# Altium project PM_TEST.PrjPcb
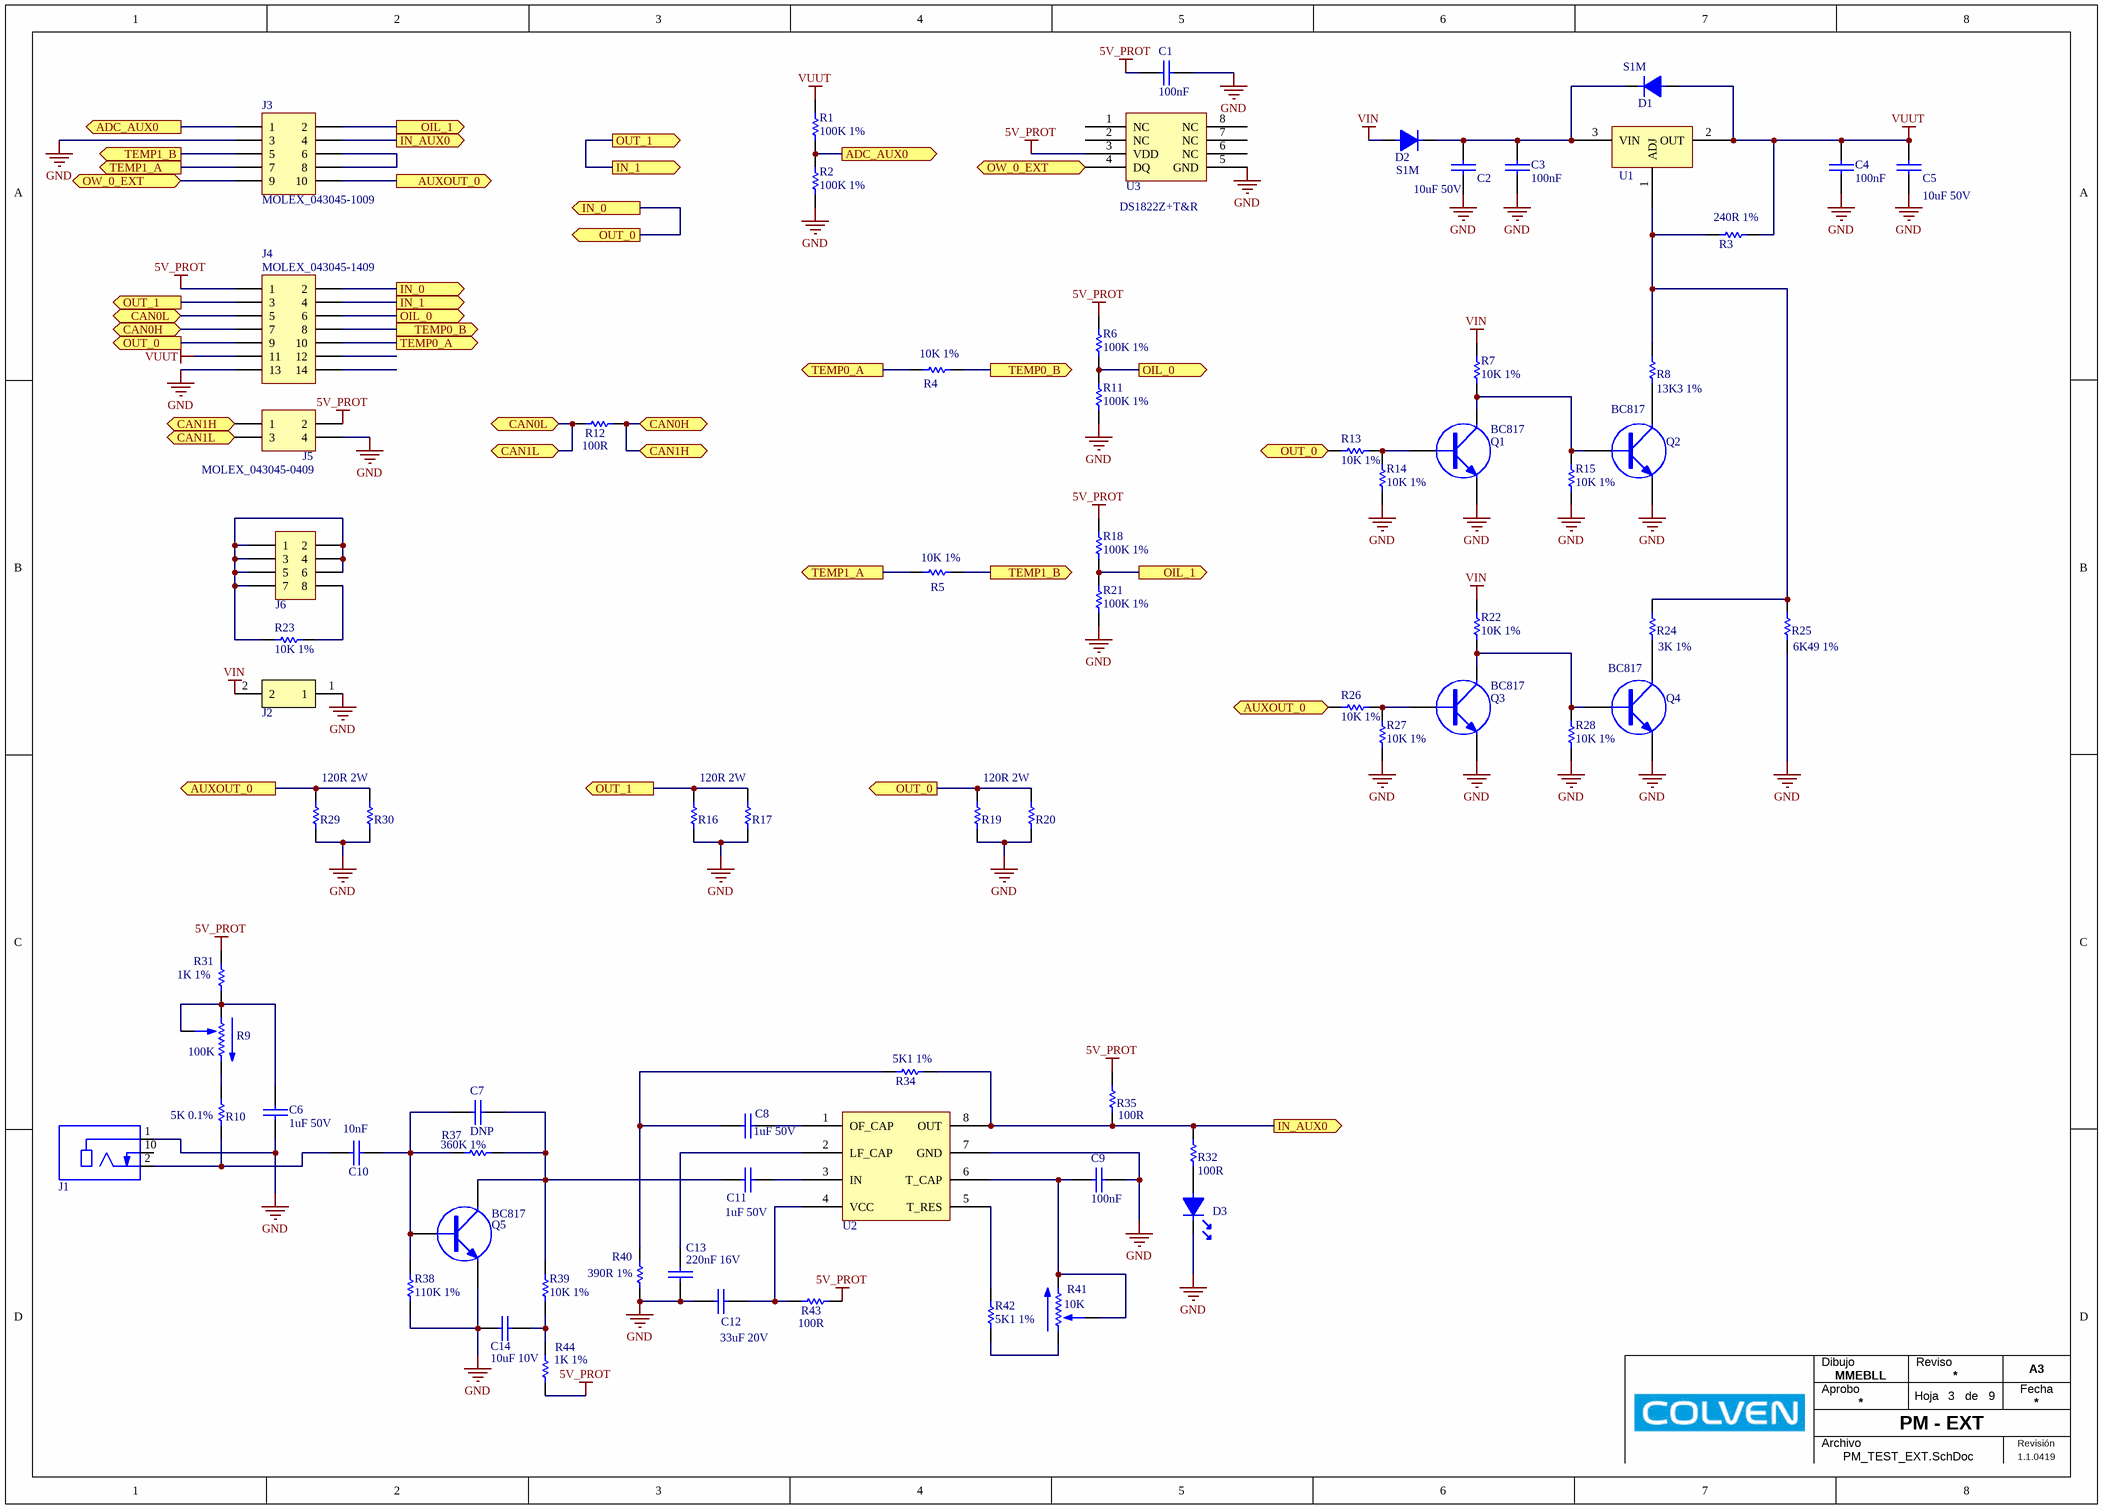
[diagram p0: PM_TEST_EXT.SchDoc]
1 sheet, 74 parts. Net scope: flat (ports and power ports of the same name join across sheets).
Board file: PM_TEST.PcbDoc

## Sheet PM_TEST_EXT.SchDoc: PM - EXT
size A3; DrawnBy: MMEBLL; Revision: 1.1.0419; SheetNumber: 3; SheetTotal: 9; PageSetup: Record=PageOptions|CenterHorizontal=True|CenterVertical=True|PrintScale=0.73|XCorrection=1.00|YCorrection=1.00|PrintKind=0|BorderSize=5000000|LeftOffset=0|BottomOffset=0|Orientation=2|PaperLength=1000|PaperWidth=1000|Scale=100|PaperSource=7|PrintQuality=-4|MediaType=1|DitherType=10|PaperKind=A4|PrintScaleMode=1

### Parts
C1  100nF  [0603]
C2  10uF 50V  [1210]
C3  100nF  [0603]
C4  100nF  [0603]
C5  10uF 50V  [1210]
C6  1uF 50V  [0603]
C7  DNP  [0603]  (no BOM)
C8  1uF 50V  [0603]
C9  100nF  [0603]
C10  10nF  [0603]
C11  1uF 50V  [0603]
C12  33uF 20V  [0805]
C13  220nF 16V  [0603]
C14  10uF 10V  [0805]
D1  S1M  [SMAK]
D2  S1M  [SMAK]
D3  AZUL  [LED0603_B]  (value not drawn)
J1  MJ-3523-SMT-TR  [MJ-3523-SMT-TR]  (value not drawn)
J2  MOLEX_0436500212  [0436500212]  (value not drawn)
J3  MOLEX_043045-1009  [043045-1009]
J4  MOLEX_043045-1409  [043045-1409]
J5  MOLEX_043045-0409  [043045-0409]
J6  75867-132LF  [75867-132LF]  (value not drawn)
Q1  BC817  [SOT23]
Q2  BC817  [SOT23]
Q3  BC817  [SOT23]
Q4  BC817  [SOT23]
Q5  BC817  [SOT23]
R1  100K 1%  [0603]
R2  100K 1%  [0603]
R3  240R 1%  [0603]
R4  10K 1%  [0603]
R5  10K 1%  [0603]
R6  100K 1%  [0603]
R7  10K 1%  [0603]
R8  13K3 1%  [0603]
R9  100K  [3386W]
R10  5K 0.1%  [0603]
R11  100K 1%  [0603]
R12  100R  [0603]
R13  10K 1%  [0603]
R14  10K 1%  [0603]
R15  10K 1%  [0603]
R16  120R 2W  [RES700]
R17  120R 2W  [RES700]  (value not drawn)
R18  100K 1%  [0603]
R19  120R 2W  [RES700]
R20  120R 2W  [RES700]  (value not drawn)
R21  100K 1%  [0603]
R22  10K 1%  [0603]
R23  10K 1%  [0603]
R24  3K 1%  [0603]
R25  6K49 1%  [0603]
R26  10K 1%  [0603]
R27  10K 1%  [0603]
R28  10K 1%  [0603]
R29  120R 2W  [RES700]
R30  120R 2W  [RES700]  (value not drawn)
R31  1K 1%  [0603]
R32  100R  [0603]
R34  5K1 1%  [0603]
R35  100R  [0603]
R37  360K 1%  [0603]
R38  110K 1%  [0603]
R39  10K 1%  [0603]
R40  390R 1%  [0603]
R41  10K  [3386W]
R42  5K1 1%  [0603]
R43  100R  [0603]
R44  1K 1%  [0603]
ROT?  Rotulo_A3  (value not drawn)  (graphical)
U1  LM317MBDTRKG  [DPAK]  (value not drawn)
U2  LM567C  [SOIC8]  (value not drawn)
U3  DS1822Z+T&R  [SOIC8]

### Ports
ADC_AUX0 (out), AUXOUT_0 (out), CAN0H (bidir), CAN0L (bidir), CAN1H (bidir), CAN1L (bidir), IN_0 (out), IN_1 (out), IN_AUX0 (out), OIL_0 (out), OIL_1 (out), OUT_0 (out), OUT_1 (out), OW_0_EXT (bidir), TEMP0_A (out), TEMP0_B (out), TEMP1_A (out), TEMP1_B (out)

### Nets
5V_PROT: C1.1 J4.1 J5.2 R6.2 R18.2 R31.2 R35.2 R43.2 R44.1 U3.3(VDD)
GND: C1.2 C2.2 C3.1 C4.1 C5.2 C6.1 C9.2 C12.1 C13.2 C14.1 D3.2 J1.1 J2.1 J3.3 J4.13 J5.4 Q1.3(E) Q2.3(E) Q3.3(E) Q4.3(E) Q5.3(E) R2.1 R11.1 R14.2 R15.2 R16.1 R17.1 R19.1 R20.1 R21.1 R25.1 R27.2 R28.2 R29.1 R30.1 R38.1 R40.1 U2.7(GND) U3.5(GND)
VIN: D2.1 J2.2 R7.1 R22.1
VUUT: C4.2 C5.1 D1.1 J4.11 R1.2 R3.2 U1.2(OUT)
NetC2_1: C2.1 C3.2 D1.2 D2.2 U1.3(VIN)
NetC6_2: C6.2 R9.1(CCW) R9.2(WIPER) R31.1
NetC7_1: C7.1 C10.2 Q5.1(B) R37.1 R38.2
NetC7_2: C7.2 C11.1 Q5.2(C) R37.2 R39.2
NetC8_1: C8.1 R34.1 R40.2
NetC8_2: C8.2 U2.1(OF_CAP)
NetC9_1: C9.1 R41.2(WIPER) R41.3(CW) U2.6(T_CAP)
NetC10_1: C10.1 J1.2 R10.1
NetC11_2: C11.2 U2.3(IN)
NetC12_2: C12.2 R43.1 U2.4(VCC)
NetC13_1: C13.1 U2.2(LF_CAP)
NetC14_2: C14.2 R39.1 R44.2
NetD3_1: D3.1 R32.1
NetJ3_1: J3.1 R1.1 R2.2 ; port ADC_AUX0
NetJ3_2: J3.2 R18.1 R21.2 ; port OIL_1
NetJ3_4: J3.4 R32.2 R34.2 R35.1 U2.8(OUT) ; port IN_AUX0
NetJ3_5: J3.5 R5.2 ; port TEMP1_B
NetJ3_6: J3.6 J3.8
NetJ3_7: J3.7 R5.1 ; port TEMP1_A
NetJ3_9: J3.9 U3.4(DQ) ; port OW_0_EXT
NetJ3_10: J3.10 R26.2 R29.2 R30.2 ; port AUXOUT_0
NetJ4_2: J4.2 J4.9 R13.2 R19.2 R20.2 ; port OUT_0, port IN_0
NetJ4_3: J4.3 J4.4 R16.2 R17.2 ; port OUT_1, port IN_1
NetJ4_5: J4.5 J5.3 R12.1 ; port CAN0L, port CAN1L
NetJ4_6: J4.6 R6.1 R11.2 ; port OIL_0
NetJ4_7: J4.7 J5.1 R12.2 ; port CAN0H, port CAN1H
NetJ4_8: J4.8 R4.2 ; port TEMP0_B
NetJ4_10: J4.10 R4.1 ; port TEMP0_A
NetJ6_1: J6.1 J6.2 J6.3 J6.4 J6.5 J6.6 J6.7 R23.1
NetJ6_8: J6.8 R23.2
NetQ1_1: Q1.1(B) R13.1 R14.1
NetQ1_2: Q1.2(C) Q2.1(B) R7.2 R15.1
NetQ2_2: Q2.2(C) R8.1
NetQ3_1: Q3.1(B) R26.1 R27.1
NetQ3_2: Q3.2(C) Q4.1(B) R22.2 R28.1
NetQ4_2: Q4.2(C) R24.1
NetR3_1: R3.1 R8.2 R24.2 R25.2 U1.1(ADJ)
NetR9_3: R9.3(CW) R10.2
NetR41_1: R41.1(CCW) R42.1
NetR42_2: R42.2 U2.5(T_RES)

Not connected (* = marked no-connect by the designer): J1 10; J4 12 14; U3 1(NC) 2(NC) 6(NC) 7(NC) 8(NC)

### Notes on the sheet
- (in symbol ROTULO_COLVEN_A3) Dibujo; Reviso; A3; Aprobo; Fecha; Hoja; de; Archivo; Revisión

### Library data of the parts
C1 C3 C4 C9 = CAP0603_100nF_X7R: CAP0603 100nF 50V X7R; CREO: CP; APROBO: EB; Part Number: CAP0603_100nF_X7R; Value: 100nF; Supplier 1: Digi-Key; Supplier Part Number 1: 490-4779-1-ND
C2 C5 = CAP1210_10uF_50V_X5R: CAP1210 10uF 50V X5R 20%; Manufacturer: Taiyo Yuden; Manufacturer Part Number: UMK325BJ106MM-T; CREO: JP; Part Number: CAP1210_10uF_50V_X5R; Value: 10uF 50V; Supplier 1: Digi-Key; Supplier Part Number 1: 587-2225-1-ND
C6 C8 C11 = CAP0603_1uF_50V_X7R: CAP0603 1uF 50V X7R; CREO: EB; Part Number: CAP0603_1uF_50V_X7R; Value: 1uF 50V; Supplier 1: Digi-Key; Supplier Part Number 1: 587-3247-1-ND
C7 = CAP0603_DNP: CAP0603 DNP; CREO: JP; Part Number: CAP0603_DNP; Value: DNP; Supplier Part Number 1: -
C10 = CAP0603_10nF_X7R: CAP0603 10nF 50V X7R; CREO: EB; Part Number: CAP0603_10nF_X7R; Value: 10nF; Supplier 1: Digi-Key; Supplier Part Number 1: 490-4778-1-ND
C12 = CAP0805_33uF_10V_X5R: CAP0805 33uF 10V X5R 20%; Manufacturer: TDK Corporation; Manufacturer Part Number: C2012X5R1A336M125AC; CREO: JP; Part Number: CAP0805_33uF_10V_X5R; Value: 33uF 20V; Supplier 1: Digi-Key; Supplier Part Number 1: 445-8238-1-ND
C13 = CAP0603_220nF_16V_X7R: CAP0603 220nF 16V X7R; Manufacturer: Murata Electronics; Manufacturer Part Number: GRM188R71C224KA01D; CREO: EB; Part Number: CAP0603_220nF_16V_X7R; Value: 220nF 16V; Supplier 1: Digi-Key; Supplier Part Number 1: 490-3293-1-ND
C14 = CAP0805_10uF_10V_Y5V: CAP0805 10uF 10V Y5V; Manufacturer: TDK Corporation; Manufacturer Part Number: C2012Y5V1A106Z; CREO: EB; Part Number: CAP0805_10uF_10V_Y5V; Value: 10uF 10V; Supplier 1: Digi-Key; Supplier Part Number 1: 445-1371-1-ND
D1 D2 = DIO_GEN_PURPOSE_S1M_SMA: DIODE GEN PURPOSE 1000V 1A SMAA; CREO: EB; Part Number: DIO_GEN_PURPOSE_S1M_SMA; Value: S1M; Supplier 1: Digi-Key; Supplier Part Number 1: S1MFSCT-ND
D3 = LED0603_AZUL: LED AZUL 0603; CREO: EB; Part Number: LED0603_AZUL; Value: AZUL
J1 = MJ-3523-SMT-TR: CONN JACK MONO 3.5MM SMD; Manufacturer: CUI Devices; Publico: JP; Part Number: MJ-3523-SMT-TR; Value: MJ-3523-SMT-TR; Manufacturer Part Number: MJ-3523-SMT-TR; Supplier 1: Digi-Key; Supplier Part Number 1: CP-3523MJCT-ND
J2 = MOLEX_0436500212: MICROFIT SMD R/A 2POS 3MM; Manufacturer_Name: Molex; Publico: JP; Datasheet Link: https://www.molex.com/pdm_docs/sd/436500212_sd.pdf; Height: 5.57mm; Manufacturer_Part_Number: 0436500212; Arrow Part Number: 0436500212; Arrow Price/Stock: https://www.arrow.com/en/products/0436500212/molex; Part Number: MOLEX_0436500212; Value: MOLEX_0436500212; Manufacturer: Molex; Manufacturer Part Number: 0436500212; Supplier 1: Digi-Key; Supplier Part Number 1: WM1890CT-ND
J3 = MOLEX_043045_HEADER_10POS: CONN HEADER SMD R/A 10POS 3MM; Manufacturer: Molex, LLC; Publico: MM; Part Number: MOLEX_043045_HEADER_10POS; Value: MOLEX_043045-1009; Manufacturer Part Number: 0430451009; Supplier 1: Digi-Key; Supplier Part Number 1: WM1829CT-ND; Aprobo: -
J4 = MOLEX_043045_HEADER_14POS: HEADER R/A SMD DR TIN 14 CKT; Manufacturer: Molex, LLC; Publico: MM; Part Number: MOLEX_043045_HEADER_14POS; Value: MOLEX_043045-1409; Manufacturer Part Number: 0430451409; Supplier 1: Digi-Key; Supplier Part Number 1: WM3257CT-ND; Aprobo: -
J5 = MOLEX_043045_HEADER_4POS: CONN HEADER SMD R/A 4POS 3MM; Manufacturer: Molex, LLC; Publico: MM; Part Number: MOLEX_043045_HEADER_4POS; Value: MOLEX_043045-0409; Manufacturer Part Number: 0430450409; Supplier 1: Digi-Key; Supplier Part Number 1: WM1826CT-ND; Aprobo: -
J6 = IDC8_75867-132LF: CONN HEADER R/A 8POS 2.54MM; Manufacturer: Amphenol ICC (FCI); Publico: JP; Part Number: IDC8_75867-132LF; Value: 75867-132LF; Manufacturer Part Number: 75867-132LF; Supplier 1: Digi-Key; Supplier Part Number 1: 75867-132LF; Aprobo: -
Q1-Q5 = BC817_SOT23: TRANSISTOR NPN 500MA 45V SOT323; Manufacturer: ON Semiconductor; Manufacturer Part Number: BC81740MTF; Publico: EB; Part Number: BC817_SOT23; Value: BC817; Supplier 1: Digi-Key; Supplier Part Number 1: BC81740MTFCT-ND; Aprobo: -
R1 R2 R6 R11 R18 R21 = RES0603_100K_1%: RES0603 100K 1%; Manufacturer: Stackpole Electronics Inc; Manufacturer Part Number: RMCF0603FG100K; Publico: JP; Part Number: RES0603_100K_1%; Value: 100K 1%; Supplier 1: Digi-Key; Supplier Part Number 1: RMCF0603FG100KCT-ND; Aprobo: -
R3 = RES0603_240R_1%: RES0603 240R 1/10W 1%; Manufacturer: Stackpole Electronics IncRMCF0603FT13K3; Manufacturer Part Number: RMCF0603FT240R; Part Number: RES0603_240R_1%; Value: 240R 1%
R4 R5 R7 R13-R15 R22 R23 R26-R28 R39 = RES0603_10K_1%: RES0603 10K 1%; Publico: JP; Part Number: RES0603_10K_1%; Value: 10K 1%; Supplier 1: Digi-Key; Supplier Part Number 1: RMCF0603FT10K0CT-ND; Aprobo: -
R8 = RES0603_13K3_1%: RES0603 13K3 1/10W 1%; Manufacturer: Stackpole Electronics IncRMCF0603FT13K3; Manufacturer Part Number: RMCF0603FT13K3; Publico: JP; Part Number: RES0603_13K3_1%; Value: 13K3 1%; Supplier 1: Digi-Key; Supplier Part Number 1: RMCF0603FT13K3CT-ND
R9 = TRIMMER_3386W_100K: 3386W TRIMMER 100K OHM 0.5W PC PIN; Manufacturer: Bourns Inc.; Manufacturer Part Number: 3386W-1-104LF; Publico: JP; Part Number: TRIMMER_3386W_100K; Value: 100K; Supplier 1: Digi-Key; Supplier Part Number 1: 3386W-104LF-ND; Aprobo: -
R10 = RES0603_5K_0.1%: RES0603 5K 1/10W 0.1%; Manufacturer: Yageo; Manufacturer Part Number: RT0603BRE075KL; Publico: JP; Part Number: RES0603_5K_0.1%; Value: 5K 0.1%; Supplier 1: Digi-Key; Supplier Part Number 1: 13-RT0603BRE075KLCT-ND
R12 R32 R35 R43 = RES0603_100R_5%: RES0603 100R 5%; Publico: EB; Part Number: RES0603_100R_5%; Value: 100R; Supplier 1: Digi-Key; Supplier Part Number 1: RMCF0603JT100RCT-ND; Aprobo: -
R16 R17 R19 R20 R29 R30 = RES700_120R_5%_2W: RES 120 OHM 2W 5% AXIAL; Manufacturer: Vishay Beyschlag/Draloric/BC Components; Manufacturer Part Number: PR02000201200JA100; Publico: JP; Part Number: RES700_120R_5%_2W; Value: 120R 2W; Supplier 1: Digi-Key; Supplier Part Number 1: BC4760CT-ND
R24 = RES0603_3K_1%: RES0603 3K 1/10W 1%; Manufacturer: Stackpole Electronics Inc; Manufacturer Part Number: RMCF0603FT3K00; Publico: JP; Part Number: RES0603_3K_1%; Value: 3K 1%; Supplier 1: Digi-Key; Supplier Part Number 1: RMCF0603FT3K00CT-ND
R25 = RES0603_6K49_1%: RES0603 6K49 1/10W 1%; Manufacturer: Stackpole Electronics Inc; Manufacturer Part Number: RMCF0603FT6K49; Publico: JP; Part Number: RES0603_6K49_1%; Value: 6K49 1%; Supplier 1: Digi-Key; Supplier Part Number 1: RMCF0603FT6K49CT-ND
R31 R44 = RES0603_1K_1%: RES0603 1K 1%; Manufacturer: Stackpole Electronics Inc; Manufacturer Part Number: RMCF0603FT1K00; Publico: EB; Part Number: RES0603_1K_1%; Value: 1K 1%; Supplier 1: Digi-Key; Supplier Part Number 1: RMCF0603FT1K00CT-ND; Aprobo: -
R34 R42 = RES0603_5K1_1%: RES 5.1K 1% 1/10W 0603; Manufacturer: Stackpole Electronics Inc; Manufacturer Part Number: RMCF0603FT5K10; Publico: JP; Part Number: RES0603_5K1_1%; Value: 5K1 1%; Supplier 1: Digi-Key; Supplier Part Number 1: RMCF0603FT5K10CT-ND; Aprobo: -
R37 = RES0603_360K_1%: RES0603 360K 1/10W 1%; Manufacturer: Stackpole Electronics Inc; Manufacturer Part Number: RMCF0603FT360K; Publico: JP; Part Number: RES0603_360K_1%; Value: 360K 1%; Supplier 1: Digi-Key; Supplier Part Number 1: 738-RMCF0603FT360KCT-ND
R38 = RES0603_110K_1%: RES0603 110K 1%; Manufacturer: Stackpole Electronics Inc; Manufacturer Part Number: RMCF0603FT110K; Publico: EB; Part Number: RES0603_110K_1%; Value: 110K 1%; Supplier 1: Digi-Key; Supplier Part Number 1: RMCF0603FT110KCT-ND; Aprobo: -
R40 = RES0603_390R_1%: RES0402 390R 1/10W 1%; Manufacturer: Stackpole Electronics Inc; Manufacturer Part Number: RMCF0603FT390R; Publico: JP; Part Number: RES0603_390R_1%; Value: 390R 1%; Supplier 1: Digi-Key; Supplier Part Number 1: RMCF0603FT390RCT-ND; Aprobo: -
R41 = TRIMMER_3386W_10K: 3386W TRIMMER 10K OHM 0.5W PC PIN; Manufacturer: Bourns Inc.; Manufacturer Part Number: 3386W-1-103LF; Publico: EB; Part Number: TRIMMER_3386W_10K; Value: 10K; Supplier 1: Digi-Key; Supplier Part Number 1: 3386W-103LF-ND; Aprobo: -
ROT? = ROTULO_COLVEN_A3: ROTULO GESTYA A3; Publico: EB; Part Number: ROTULO_COLVEN_A3
U1 = LM317MBDTRKG_DPAK: Linear Voltage Regulator IC Positive Adjustable Output 500mA DPAK; Manufacturer: ON Semiconductor; Publico: JP; Part Number: LM317MBDTRKG_DPAK; Value: LM317MBDTRKG; Manufacturer Part Number: LM317MBDTRKG; Supplier 1: Digi-Key; Supplier Part Number 1: LM317MBDTRKGOSCT-ND
U2 = LM567C: Telecom IC Tone Decoder 8-SOIC; Manufacturer: Texas Instruments; Manufacturer Part Number: LM567CMX/NOPB; Publico: JP; Part Number: LM567C; Value: LM567C; Supplier 1: Digi-Key; Supplier Part Number 1: 296-38556-1-ND
U3 = DS1822Z+T&R_SOIC8: Temperature Sensor Digital, Local -55°C ~ 125°C 11 b 8-SOIC; Manufacturer: Maxim Integrated; Publico: JP; Part Number: DS1822Z+T&R_SOIC8; Value: DS1822Z+T&R; Manufacturer Part Number: DS1822Z+T&R; Supplier 1: Digi-Key; Supplier Part Number 1: DS1822Z+CT-ND